# EAGLE design keyboard_5keys_board_drc_filled (EAGLE 7.5.0)
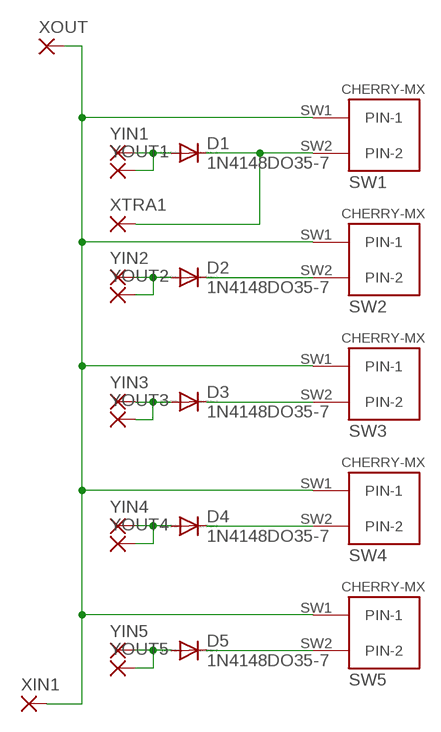
[diagram p0: schematic, sheet 1]

## Parts
D1  1N4148DO35-7  [DO35-7]
D2  1N4148DO35-7  [DO35-7]
D3  1N4148DO35-7  [DO35-7]
D4  1N4148DO35-7  [DO35-7]
D5  1N4148DO35-7  [DO35-7]
SW1  CHERRY-MX  [CHERRY-MX]
SW2  CHERRY-MX  [CHERRY-MX]
SW3  CHERRY-MX  [CHERRY-MX]
SW4  CHERRY-MX  [CHERRY-MX]
SW5  CHERRY-MX  [CHERRY-MX]
XIN1  1,6/0,8  [1,6/0,8]
XOUT  1,6/0,8  [1,6/0,8]
XTRA1  1,6/0,8  [1,6/0,8]
YIN1  1,6/0,8  [1,6/0,8]
YIN2  1,6/0,8  [1,6/0,8]
YIN3  1,6/0,8  [1,6/0,8]
YIN4  1,6/0,8  [1,6/0,8]
YIN5  1,6/0,8  [1,6/0,8]
YOUT1  1,6/0,8  [1,6/0,8]
YOUT2  1,6/0,8  [1,6/0,8]
YOUT3  1,6/0,8  [1,6/0,8]
YOUT4  1,6/0,8  [1,6/0,8]
YOUT5  1,6/0,8  [1,6/0,8]

## Nets
N$1: D3.A YIN3.1(P) YOUT3.1(P)
N$2: D5.C SW5.SW2(PIN-2)
N$3: D4.C SW4.SW2(PIN-2)
N$4: D3.C SW3.SW2(PIN-2)
N$5: D1.C SW1.SW2(PIN-2) XTRA1.1(P)
N$6: D1.A YIN1.1(P) YOUT1.1(P)
N$7: D2.A YIN2.1(P) YOUT2.1(P)
N$8: D2.C SW2.SW2(PIN-2)
N$9: D4.A YIN4.1(P) YOUT4.1(P)
N$10: D5.A YIN5.1(P) YOUT5.1(P)
XOUT: SW1.SW1(PIN-1) SW2.SW1(PIN-1) SW3.SW1(PIN-1) SW4.SW1(PIN-1) SW5.SW1(PIN-1) XIN1.1(P) XOUT.1(P)

## Library data of the parts
D1-D5 = diode:1N4148: DIODE high speed (Philips)
SW1-SW5 = cherrymx:CHERRY-MX: Cherry MX series keyswitch
XIN1 XOUT XTRA1 YIN1-YIN5 YOUT1-YOUT5 = wirepad:1,6/0,8: THROUGH-HOLE PAD

## Board
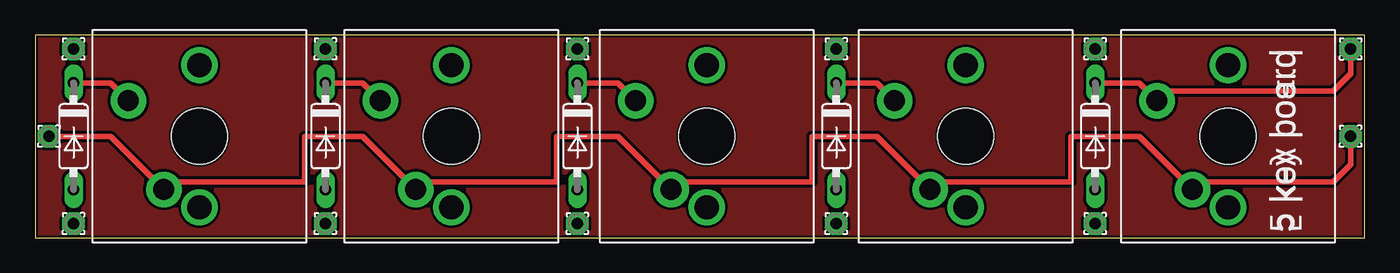
[diagram p1: board, top side]
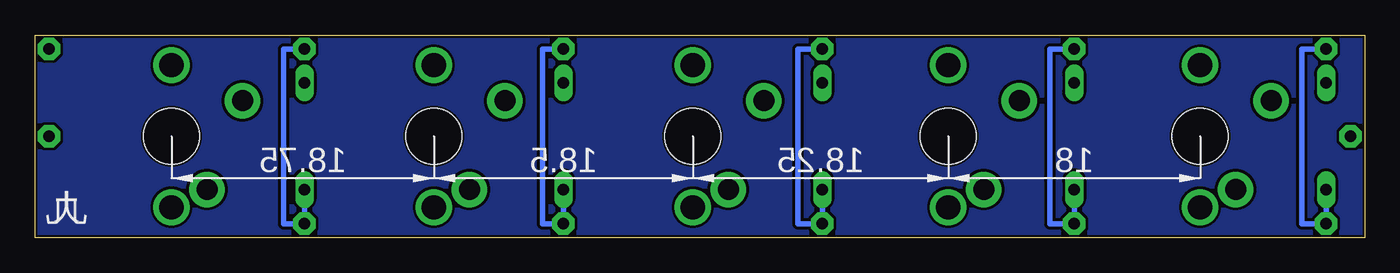
[diagram p2: board, bottom side, seen from below]

Size 95 x 14.5 mm. Coordinates in mm from the lower left corner, seen from the top.
Outline: 0,14.5 0,0 95,0 95,14.5 0,14.5
Copper layers (1*16): Top 0.035mm / dielectric 1.5mm / Bottom 0.035mm
Design rules "default *": minimum track width 10mil, minimum drill 24mil, track to track 8mil, track to pad 8mil, pad to pad 8mil, via to via 8mil, smd to smd 8mil, copper to edge 0.15mm, drill to drill 1.5mm, minimum pad ring 10mil, minimum via ring 8mil, stop-mask expansion 4mil, vias tented up to drill 0mil, thermal gap 10mil

### Footprints (pad centres in the part's own frame; a part is rotated, then mirrored left to right if it is on the bottom)
DO35-7 = drill 0.813 long: A 3.81,0; C -3.81,0
CHERRY-MX = drill 1.714 pad 1.93: P$3 -5.08,0; P$4 5.08,0 | drill 1.5 pad 2.54: SW1 -3.81,2.54; SW2 2.54,5.08 | hole 4: 0,0
1,6/0,8 = drill 0.813 pad 1.6 octagon: 1 0,0

### Placement (x,y rotation side)
D1  75.75,7.25 270 top
D2  57.25,7.25 270 top
D3  38.75,7.25 270 top
D4  20.75,7.25 270 top
D5  2.75,7.25 270 top
SW1  85.25,7.25 90 top
SW2  66.5,7.25 90 top
SW3  48,7.25 90 top
SW4  29.75,7.25 90 top
SW5  11.75,7.25 90 top
XIN1  94,7.25 0 top
XOUT  1,7.25 0 top
XTRA1  94,13.5 90 top
YIN1  75.75,1 0 top
YIN2  57.25,1 0 top
YIN3  38.75,1 0 top
YIN4  20.75,1 0 top
YIN5  2.75,1 0 top
YOUT1  75.75,13.5 0 top
YOUT2  57.25,13.5 0 top
YOUT3  38.75,13.5 0 top
YOUT4  20.75,13.5 0 top
YOUT5  2.75,13.5 0 top

### Tracks (layer width: path | path; a pad name or v marks a point on that pad's centre or on a via)
N$1
  Bottom 0.406: YOUT3.1 40.5,13.5 40.5,1 YIN3.1 D3.A
N$2
  Top 0.406: SW5.SW2 5.4,11.06 D5.C
N$3
  Top 0.406: SW4.SW2 23.4,11.06 D4.C
N$4
  Top 0.406: SW3.SW2 41.65,11.06 D3.C
N$5
  Top 0.406: D1.C 78.9,11.06 SW1.SW2 80.88,10.5 92.75,10.5 94,11.75 XTRA1.1
N$6
  Bottom 0.406: YOUT1.1 77.25,13.5 77.25,1 YIN1.1 D1.A
N$7
  Bottom 0.406: YOUT2.1 58.75,13.5 58.75,1 YIN2.1 D2.A
N$8
  Top 0.406: SW2.SW2 60.15,11.06 D2.C
N$9
  Bottom 0.406: D4.A YIN4.1 22.5,1 22.5,13.5 YOUT4.1
N$10
  Bottom 0.406: YOUT5.1 4.5,13.5 4.5,1 YIN5.1 D5.A
N$11
  pour Bottom: 0,14.5 0,0 95,0 95,14.5
N$12
  pour Top: 0,14.5 0,0 95,0 95,14.5
XOUT
  Top 0.406: XOUT.1 5.4,7.25 SW5.SW1 9.77,4 19.25,4 19.25,7.25 23.4,7.25 SW4.SW1 27.77,4 37.25,4 37.25,7.25 41.65,7.25 SW3.SW1 46.02,4 55.5,4 55.5,7.25 60.15,7.25 SW2.SW1 64.52,4 74,4 74,7.25 78.9,7.25 SW1.SW1 83.27,4 92.75,4 94,5.25 XIN1.1

### Text on the board
tPlace: 5 key board | 5 key board
bPlace: 九 | 九